# Altium project FEU31_Part1.PrjPcb
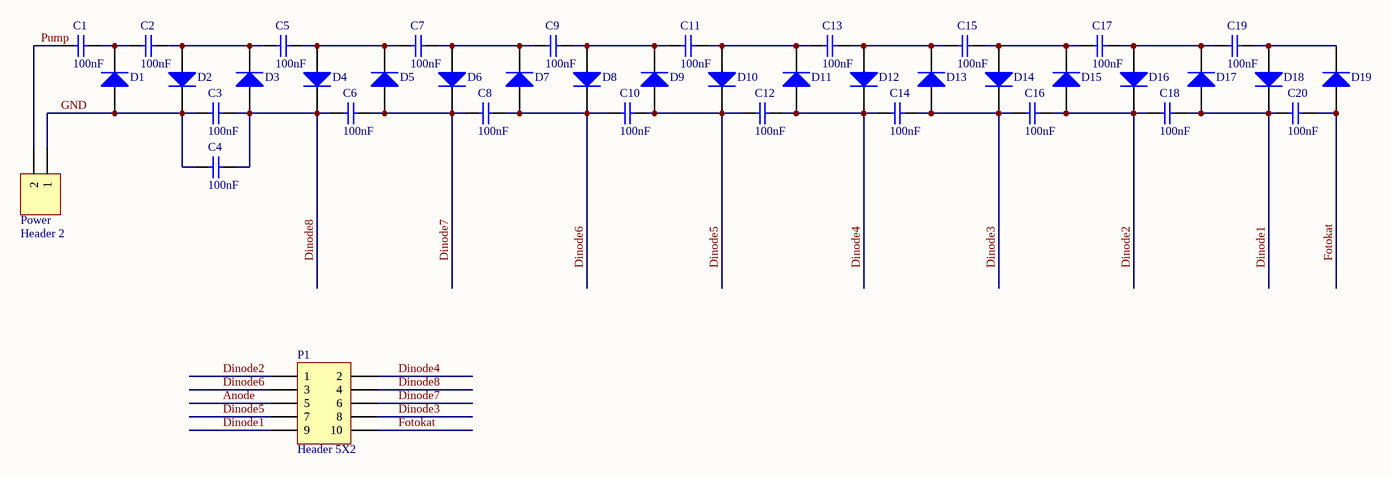
[diagram p0: FEU31_Part1.SchDoc]
1 sheet, 41 parts. Net scope: global (net labels, ports and power ports of the same name join across sheets).
Board file: FEU31_Part1.PcbDoc

## Sheet FEU31_Part1.SchDoc: Интерфейсный модуль ФЭУ-102
size A3; Address1: (с) Быканов Андрей; Address2: г.Тула 2016г.; Revision: 1.3

### Parts
C1  100nF  [C1206]
C2  100nF  [C1206]
C3  100nF  [C1206]
C4  100nF  [C1206]
C5  100nF  [C1206]
C6  100nF  [C1206]
C7  100nF  [C1206]
C8  100nF  [C1206]
C9  100nF  [C1206]
C10  100nF  [C1206]
C11  100nF  [C1206]
C12  100nF  [C1206]
C13  100nF  [C1206]
C14  100nF  [C1206]
C15  100nF  [C1206]
C16  100nF  [C1206]
C17  100nF  [C1206]
C18  100nF  [C1206]
C19  100nF  [C1206]
C20  100nF  [C1206]
D1  (no value)  [DA2JF8100L]
D2  (no value)  [DA2JF8100L]
D3  (no value)  [DA2JF8100L]
D4  (no value)  [DA2JF8100L]
D5  (no value)  [DA2JF8100L]
D6  (no value)  [DA2JF8100L]
D7  (no value)  [DA2JF8100L]
D8  (no value)  [DA2JF8100L]
D9  (no value)  [DA2JF8100L]
D10  (no value)  [DA2JF8100L]
D11  (no value)  [DA2JF8100L]
D12  (no value)  [DA2JF8100L]
D13  (no value)  [DA2JF8100L]
D14  (no value)  [DA2JF8100L]
D15  (no value)  [DA2JF8100L]
D16  (no value)  [DA2JF8100L]
D17  (no value)  [DA2JF8100L]
D18  (no value)  [DA2JF8100L]
D19  (no value)  [DA2JF8100L]
P1  Header 5X2  [ФЭУ-31]
Power  Header 2  [HDR1X2]

### Nets
Anode: P1.5
Dinode1: C18.1 C20.2 D17.1(A) D18.2(K) P1.9
Dinode2: C16.1 C18.2 D15.1(A) D16.2(K) P1.1
Dinode3: C14.1 C16.2 D13.1(A) D14.2(K) P1.8
Dinode4: C12.1 C14.2 D11.1(A) D12.2(K) P1.2
Dinode5: C10.1 C12.2 D9.1(A) D10.2(K) P1.7
Dinode6: C8.1 C10.2 D7.1(A) D8.2(K) P1.3
Dinode7: C6.1 C8.2 D5.1(A) D6.2(K) P1.6
Dinode8: C3.1 C4.1 C6.2 D3.1(A) D4.2(K) P1.4
Fotokat: C20.1 D19.1(A) P1.10
GND: C3.2 C4.2 D1.1(A) D2.2(K) Power.1
Pump: C1.2 Power.2
NetC1_1: C1.1 C2.2 D1.2(K)
NetC2_1: C2.1 C5.2 D2.1(A) D3.2(K)
NetC5_1: C5.1 C7.2 D4.1(A) D5.2(K)
NetC7_1: C7.1 C9.2 D6.1(A) D7.2(K)
NetC9_1: C9.1 C11.2 D8.1(A) D9.2(K)
NetC11_1: C11.1 C13.2 D10.1(A) D11.2(K)
NetC13_1: C13.1 C15.2 D12.1(A) D13.2(K)
NetC15_1: C15.1 C17.2 D14.1(A) D15.2(K)
NetC17_1: C17.1 C19.2 D16.1(A) D17.2(K)
NetC19_1: C19.1 D18.1(A) D19.2(K)

### Notes on the sheet
- Title
- Size:
- Date:
- A3
- Number:
- Time:
- Revision:
- Sheet
- of
- File:

### Library data of the parts
C1-C20 = Cap Semi: Capacitor (Semiconductor SIM Model); Order: CGA5L4X7T2W104K; Published: 8-Jun-2000; LatestRevisionDate: 29-May-2009; LatestRevisionNote: IPC-7351 Footprint Added.; PackageReference: C1206; Publisher: Altium Limited; PackageDescription: Chip Capacitor; Value: 100nF
D1-D19 = Diode: Default Diode; Value: DA2JF8100L; Published: 8-Jun-2000; LatestRevisionDate: 17-Jul-2002; LatestRevisionNote: Re-released for DXP Platform.; PackageVersion: Sep-1996; PackageReference: SMC; Publisher: Altium Limited; PackageDescription: DO-214-AB/SMC; 2 C-Bend Leads; Body 7.9 x 5.9 mm, inc. leads (LxW); Code_JEDEC: DO-214-AB; Order: DA2JF8100L
P1 = Header 5X2: Header, 5-Pin, Dual row; LatestRevisionDate: 17-Jul-2002; LatestRevisionNote: Re-released for DXP Platform.; Publisher: Altium Limited
Power = Header 2: Header, 2-Pin; LatestRevisionDate: 17-Jul-2002; LatestRevisionNote: Re-released for DXP Platform.; Publisher: Altium Limited